# Altium schematic sheet RS_MCU.SchDoc: ЖД Весы Датчик
size 420 x 297 mm; Author: НПК "Автоматизация"; CompanyName: НПК "Автоматизация"; Organization: НПК "Автоматизация"; Revision: 1.0; SheetNumber: 2; SheetTotal: 3
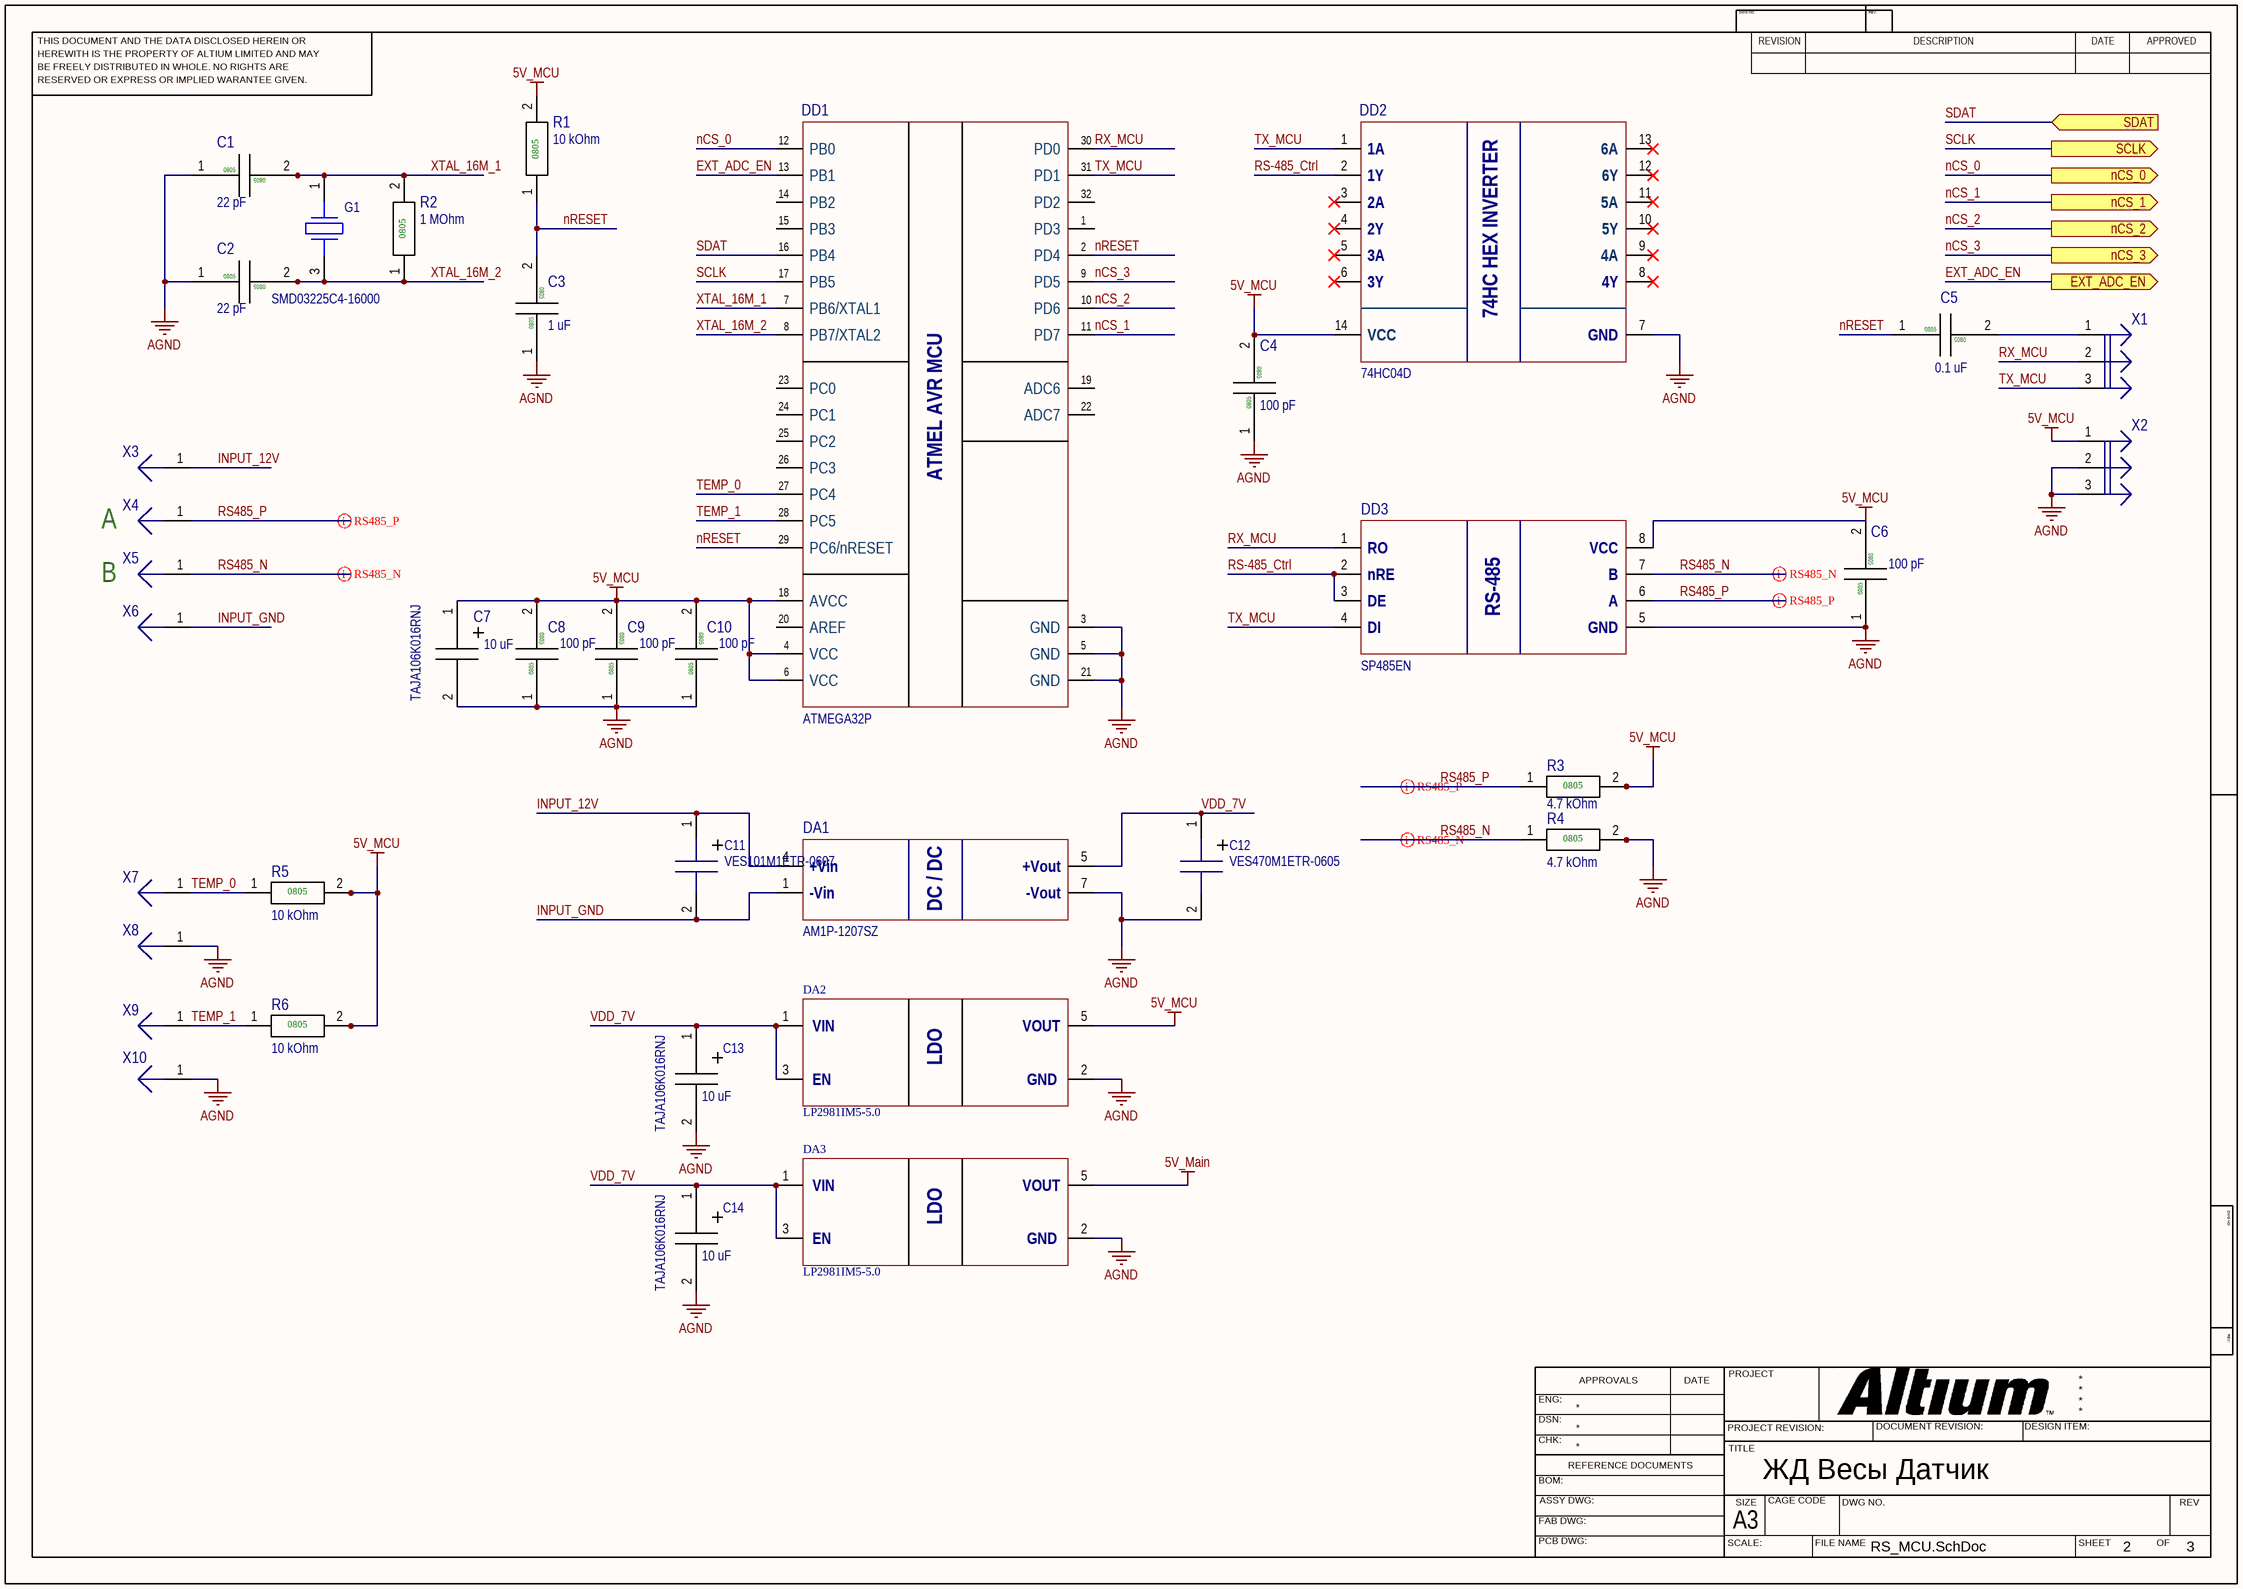
[diagram p0: RS_MCU.SchDoc]

## Parts
C1  22 pF  [CAP: 0805]
C2  22 pF  [CAP: 0805]
C3  1 uF  [CAP: 0805]
C4  100 pF  [CAP: 0805]
C5  0.1 uF  [CAP: 0805]
C6  100 pF  [CAP: 0805]
C7  TAJA106K016RNJ  CapValue: 10 uF  [CAP: TANTAL-A]
C8  100 pF  [CAP: 0805]
C9  100 pF  [CAP: 0805]
C10  100 pF  [CAP: 0805]
C11  VES101M1ETR-0607  [CAPAE-C]
C12  VES470M1ETR-0605  [CAPAE-C]
C13  TAJA106K016RNJ  CapValue: 10 uF  [CAP: TANTAL-A]
C14  TAJA106K016RNJ  CapValue: 10 uF  [CAP: TANTAL-A]
DA1  AM1P-1207SZ  [MOD_AM1P-Z]
DA2  LP2981IM5-5.0  [SOT-23-5]
DA3  LP2981IM5-5.0  [SOT-23-5]
DD1  ATMEGA32P  [32-LQFP]
DD2  74HC04D  [14-SOIC]
DD3  SP485EN  [8-SOIC]
G1  SMD03225C4-16000  [OSC: 3225]
R1  10 kOhm  [RES: 0805]
R2  1 MOhm  [RES: 0805]
R3  4.7 kOhm  [RES: 0805]
R4  4.7 kOhm  [RES: 0805]
R5  10 kOhm  [RES: 0805]
R6  10 kOhm  [RES: 0805]
X1  PLS-1X3Pin 2.54  [CON: PLS-3]  (value not drawn)
X2  PLS-1X3Pin 2.54  [CON: PLS-3]  (value not drawn)
X3  PowerSingleHole  [PowerSingle]  (value not drawn)
X4  PowerSingleHole  [PowerSingle]  (value not drawn)
X5  PowerSingleHole  [PowerSingle]  (value not drawn)
X6  PowerSingleHole  [PowerSingle]  (value not drawn)
X7  PowerSingleHole  [PowerSingle]  (value not drawn)
X8  PowerSingleHole  [PowerSingle]  (value not drawn)
X9  PowerSingleHole  [PowerSingle]  (value not drawn)
X10  PowerSingleHole  [PowerSingle]  (value not drawn)

## Ports
EXT_ADC_EN (out), nCS_0 (out), nCS_1 (out), nCS_2 (out), nCS_3 (out), SCLK (out), SDAT (in)

## Nets
5V_Main: DA3.5(VOUT)
5V_MCU: C4.2 C6.2 C7.1 C8.2 C9.2 C10.2 DA2.5(VOUT) DD1.4(VCC) DD1.6(VCC) DD1.18(AVCC) DD2.14(VCC) DD3.8(VCC) R1.2 R3.2 R5.2 R6.2 X2.1
AGND: C1.1 C2.1 C3.1 C4.1 C6.1 C7.2 C8.1 C9.1 C10.1 C12.2 C13.2 C14.2 DA1.7(-Vout) DA2.2(GND) DA3.2(GND) DD1.3(GND) DD1.5(GND) DD1.21(GND) DD2.7(GND) DD3.5(GND) R4.2 X2.2 X2.3 X8.1 X10.1
EXT_ADC_EN: DD1.13(PB1) ; port EXT_ADC_EN
INPUT_12V: C11.1 DA1.4(+Vin) X3.1
INPUT_GND: C11.2 DA1.1(-Vin) X6.1
nCS_0: DD1.12(PB0) ; port nCS_0
nCS_1: DD1.11(PD7) ; port nCS_1
nCS_2: DD1.10(PD6) ; port nCS_2
nCS_3: DD1.9(PD5) ; port nCS_3
nRESET: C3.2 C5.1 DD1.2(PD4) DD1.29(PC6/nRESET) R1.1
RS485_N: DD3.7(B) R4.1 X5.1
RS485_P: DD3.6(A) R3.1 X4.1
RS-485_Ctrl: DD2.2(1Y) DD3.2(nRE) DD3.3(DE)
RX_MCU: DD1.30(PD0) DD3.1(RO) X1.2
SCLK: DD1.17(PB5) ; port SCLK
SDAT: DD1.16(PB4) ; port SDAT
TEMP_0: DD1.27(PC4) R5.1 X7.1
TEMP_1: DD1.28(PC5) R6.1 X9.1
TX_MCU: DD1.31(PD1) DD2.1(1A) DD3.4(DI) X1.3
VDD_7V: C12.1 C13.1 C14.1 DA1.5(+Vout) DA2.1(VIN) DA2.3(EN) DA3.1(VIN) DA3.3(EN)
XTAL_16M_1: C1.2 DD1.7(PB6/XTAL1) G1.1 R2.2
XTAL_16M_2: C2.2 DD1.8(PB7/XTAL2) G1.3 R2.1
NetC5_2: C5.2 X1.1

Not connected (* = marked no-connect by the designer): DD1 1(PD3) 14(PB2) 15(PB3) 19(ADC6) 20(AREF) 22(ADC7) 23(PC0) 24(PC1) 25(PC2) 26(PC3) 32(PD2); DD2 3(2A)* 4(2Y)* 5(3A)* 6(3Y)* 8(4Y)* 9(4A)* 10(5Y)* 11(5A)* 12(6Y)* 13(6A)*

## Layout directives
differential pair: RS485_N, RS485_P

## Notes on the sheet
- A
- B
- THIS DOCUMENT AND THE DATA DISCLOSED HEREIN OR
- HEREWITH IS THE PROPERTY OF ALTIUM LIMITED AND MAY
- DWG NO:
- REVISION
- REV:
- DESCRIPTION
- DATE
- APPROVED
- BE FREELY DISTRIBUTED IN WHOLE. NO RIGHTS ARE
- RESERVED OR EXPRESS OR IMPLIED WARANTEE GIVEN.
- ENG:
- APPROVALS
- PROJECT
- DSN:
- CHK:
- REFERENCE DOCUMENTS
- PROJECT REVISION:
- TITLE
- DOCUMENT REVISION:
- DESIGN ITEM:
- BOM:
- FAB DWG:
- PCB DWG:
- ASSY DWG:
- SCALE:
- A3
- SIZE
- CAGE CODE
- FILE NAME
- DWG NO.
- SHEET
- OF
- REV
- (in symbol 0.1 uF 50V 20%) 0805
- (in symbol 1 uF 50V 20%) 0805
- (in symbol 1M 1% 1/8W) 0805
- (in symbol 4.7k 1% 1/8W) 0805
- (in symbol 10k 1% 1/8W) 0805
- (in symbol 22 pF 50V 5%) 0805
- (in symbol 74HC04D) 74HC HEX INVERTER
- (in symbol 100 pF 50V 5%) 0805
- (in symbol AM1P-1207SZ) DC / DC
- (in symbol ATMega238P) ATMEL AVR MCU
- (in symbol LP2981IM5-5.0) LDO
- (in symbol SP485EN) RS-485

## Library data of the parts
C1 C2 = 22 pF 50V 5%: 50V 22pF C0G ±5% 0805 Multilayer Ceramic Capacitors MLCC - SMD/SMT ROHS; Manufacturer: FH(Guangdong Fenghua Advanced Tech); Marker: 0805CG220J500NT; Values: 22 pF 50V 5%; Capacitance: 22 pF; Voltage: 50 V; Tolerance: 5%; Shop Link: ?; LCSC Part Number: C24658
C3 = 1 uF 50V 20%: Ceramic capacitor 0805 surface mount; Manufacturer: Samsung Electro-Mechanics; Marker: CL21B105KBFNNNE; Voltage: 50 V; Tolerance: 20%; Values: 1 uF 50V 20%; Capacitance: 1 uF; Shop Link: ?; LCSC Part Number: C28323
C4 C6 C8-C10 = 100 pF 50V 5%: Ceramic capacitor 0805 surface mount; Manufacturer: Samsung Electro-Mechanics; Marker: CL21C101JBANNNC; Voltage: 50 V; Tolerance: 5%; Values: 100 pF 50V 5%; Capacitance: 100 pF; Shop Link: ?; LCSC Part Number: C1790
C5 = 0.1 uF 50V 20%: Ceramic capacitor 0805 surface mount; Manufacturer: Yageo; Marker: CC0805KRX7R9BB104; Voltage: 50 V; Tolerance: 20%; Values: 0.1 uF 50V 20%; Capacitance: 0.1 uF; Shop Link: ?; LCSC Part Number: C49678
C7 C13 C14 = 10uF 16V 10%: 10uF 16V 3Ω@100kHz -55℃~+125℃ ±10% CASE-A_3216 Tantalum Capacitors ROHS; Manufacturer: AVX; Tolerance: 10%; Marker: TAJA106K016RNJ; Voltage: 16 V; Package: CASE A SMD 1206 (3216-18); LCSC Part Number: C7171
C11 = 47uF 25V: -45℃~+105℃ 1000hrs@105℃ 100uF 7.7mm 25V 6.3mm ±20% SMD,D6.3xL7.7mm Aluminum Electrolytic Capacitors - SMD ROHS; Manufacturer: Lelon; LCSC Part Number: C176675; Marker: VES101M1ETR-0607; Capacitance: 100 uF; Voltage: 25 V
C12 = 47uF 25V: 1000hrs@105℃ -45℃~+105℃ 47uF 5.3mm 25V 6.3mm ±20% SMD,6.3x5.3mm Aluminum Electrolytic Capacitors - SMD ROHS; Manufacturer: Lelon; LCSC Part Number: C176679; Marker: VES470M1ETR-0605; Capacitance: 47 uF; Voltage: 25 V
DA1 = AM1P-1207SZ: 1W, FIXED INPUT, ISOLATED & REGULATED  SINGLE OUTPUT DC-DC CONVERTER; Manufacturer: AIMTEC; Isolation(DC): 1 kV; LCSC Part Number: --; Marker: AM1P-1207SZ; ComponentLink1Description: Shop Link; ComponentLink1URL: https://www.chipdip.ru/product0/8954725273
DA2 DA3 = LP2981IM5-5.0: Micropower 100-mA Ultralow Dropout Regulator in SOT-23 Package; Manufacturer: Texas Instruments Incorporated; Input Voltage: 6.5 - 7.5 V; Output Voltage: 5 V; Marker: LP2981IM5-5.0; LCSC Part Number: C3749295
DD1 = ATMega238P: Manufacturer: Atmel; Marker: ATMEGA32P; Shop Link: *; Core: *; ROM: *; SRAM: *; FLASH: *
DD2 = 74HC04D: Manufacturer: Shenzhen Fuman Elec; Marker: 74HC04D; LCSC Part Number: C86613
DD3 = SP485EN: Enhanced Low Power Half-Duplex / RS-485 Transceivers; Manufacturer: UMW(Youtai Semiconductor Co., Ltd.; LCSC Part Number: C23492; Marker: SP485EN
G1 = SMD03225C4-16000: Crystals WE-XTAL 16.0MHz 50ppm 13.4 x 4.9mm; Manufacturer: SDE; Frequency: 16 MHz; Marker: SMD03225C4-16000; LCSC Part Number: *; ComponentLink1Description: Shop Link; ComponentLink1URL: https://www.chipdip.ru/product0/8010208543
R1 R5 R6 = 10k 1% 1/8W: LEAD-FREE THICK FILM CHIP RESISTORS; Manufacturer: Uniroyal Elec; Marker: 0805W8F1002T5E; Tolerance: 1%; Power: 1/8 W; Resistance: 10 kOhm; LCSC Part Number: C17414
R2 = 1M 1% 1/8W: LEAD-FREE THICK FILM CHIP RESISTORS; Manufacturer: Uniroyal Elec; Marker: 0805W8F1004T5E; Tolerance: 1%; Power: 1/8 W; Resistance: 1 MOhm; LCSC Part Number: C17514
R3 R4 = 4.7k 1% 1/8W: LEAD-FREE THICK FILM CHIP RESISTORS; Manufacturer: Uniroyal Elec; Marker: 0805W8F4701T5E; Tolerance: 1%; Power: 1/8 W; Resistance: 4.7 kOhm; LCSC Part Number: C17673
X1 X2 = PLS-1X3Pin 2.54: Marker: PLS-1X3Pin 2.54